# Altium schematic sheet SeptinaryAI_Balldi__elec_driver__driver_2023-07-21.schdoc
size 671 x 250 mm
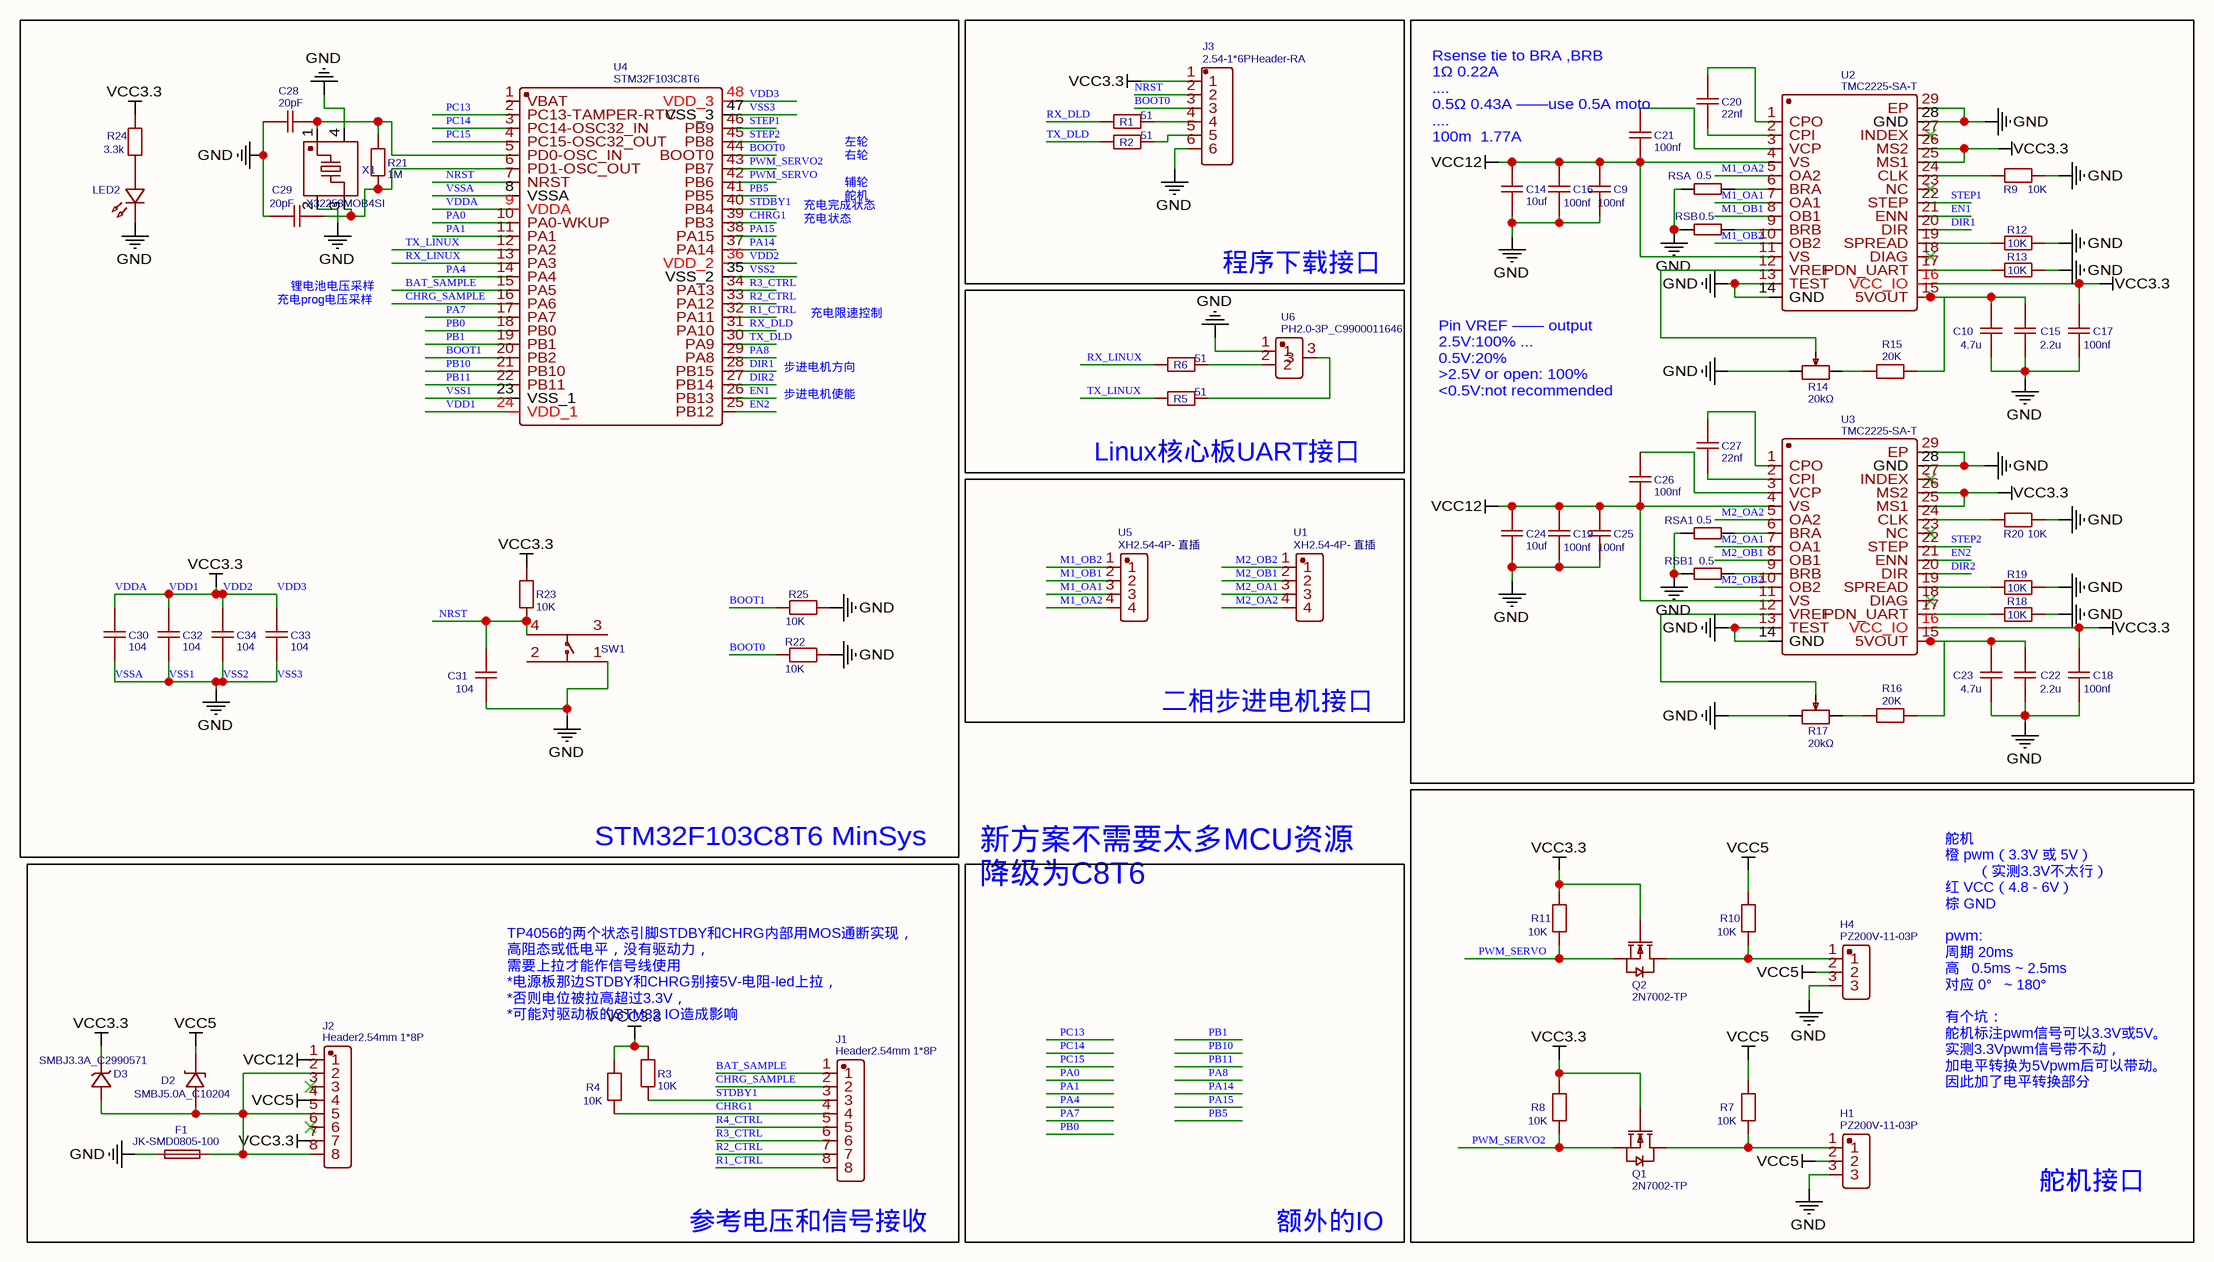
[diagram p0: SeptinaryAI_Balldi__elec_driver__driver_2023-07-21.schdoc]

## Parts
C9  100nf  [C0603]
C10  4.7u  [C0603]
C14  10uf  [C0603]
C15  2.2u  [C0603]
C16  100nf  [C0603]
C17  100nf  [C0603]
C18  100nf  [C0603]
C19  100nf  [C0603]
C20  22nf  [C0603]
C21  100nf  [C0603]
C22  2.2u  [C0603]
C23  4.7u  [C0603]
C24  10uf  [C0603]
C25  100nf  [C0603]
C26  100nf  [C0603]
C27  22nf  [C0603]
C28  20pF  [C0603]
C29  20pF  [C0603]
C30  104  [C0603]
C31  104  [C0603]
C32  104  [C0603]
C33  104  [C0603]
C34  104  [C0603]
D2  SMBJ5.0A_C10204  [SMB_L4.6-W3.6-LS5.3-R-RD]
D3  SMBJ3.3A_C2990571  [SMB_L4.6-W3.6-LS5.3-R-RD]
F1  JK-SMD0805-100  [F0805]
H1  PZ200V-11-03P  [HDR-TH_3P-P2.00-V-M]
H4  PZ200V-11-03P  [HDR-TH_3P-P2.00-V-M]
J1  Header2.54mm 1*8P  [HDR-TH_8P-P2.54-V-M]
J2  Header2.54mm 1*8P  [HDR-TH_8P-P2.54-V-M]
J3  2.54-1*6PHeader-RA  [HDR-TH_6P-P2.54-H-M-W10.0]
LED2  LC191TBCT  [LED0603-RD]  (value not drawn)
Q1  2N7002-TP  [SOT-23-3_L2.9-W1.3-P1.90-LS2.4-BR]
Q2  2N7002-TP  [SOT-23-3_L2.9-W1.3-P1.90-LS2.4-BR]
R1  51  [R0603]
R2  51  [R0603]
R3  10K  [R0603]
R4  10K  [R0603]
R5  51  [R0603]
R6  51  [R0603]
R7  10K  [R0603]
R8  10K  [R0603]
R9  10K  [R0603]
R10  10K  [R0603]
R11  10K  [R0603]
R12  10K  [R0603]
R13  10K  [R0603]
R14  20kΩ  [RES-ADJ-SMD_EVM3ESX50B24]
R15  20K  [R0603]
R16  20K  [R0603]
R17  20kΩ  [RES-ADJ-SMD_EVM3ESX50B24]
R18  10K  [R0603]
R19  10K  [R0603]
R20  10K  [R0603]
R21  1M  [R0603]
R22  10K  [R0603]
R23  10K  [R0603]
R24  3.3k  [R0603]
R25  10K  [R0603]
RSA  0.5  [R1206]
RSA1  0.5  [R1206]
RSB  0.5  [R1206]
RSB1  0.5  [R1206]
SW1  K2-1109SP-A4SA  [KEY-SMD_4P-L4.5-W4.5-P3.00-LS7.0]  (value not drawn)
U1  XH2.54-4P- 直插  [CONN-TH_4P-P2.50-XH2.54-4P]
U2  TMC2225-SA-T  [HTSSOP-28_L9.8-W4.5-P0.65-LS6.6-BL-EP]
U3  TMC2225-SA-T  [HTSSOP-28_L9.8-W4.5-P0.65-LS6.6-BL-EP]
U4  STM32F103C8T6  [LQFP-48_L7.0-W7.0-P0.50-LS9.0-BL]
U5  XH2.54-4P- 直插  [CONN-TH_4P-P2.50-XH2.54-4P]
U6  PH2.0-3P_C9900011646  [CONN-TH_3P-P2.00_HX20007-3A]
X1  X32258MOB4SI  [OSC-SMD_4P-L3.2-W2.5-BL]

## Blocks framed on the sheet
STM32F103C8T6 MinSys: C28-C34 LED2 R21-R25 SW1 U4 X1
程序下载接口: J3 R1 R2
舵机接口: H1 H4 Q1 Q2 R7 R8 R10 R11

## Nets
VCC5: D2.2(K) H1.2 H4.2 J2.4 R7.1 R10.1
VCC12: C9.2 C14.2 C16.2 C19.2 C21.1 C24.2 C25.2 C26.1 J2.1 U2.4(VS) U2.11(VS) U3.4(VS) U3.11(VS)
VDD1: C17.2 C18.2 C30.2 C32.2 C33.2 C34.2 D3.2(C) J2.7 J3.1 Q1.1(G) Q2.1(G) R3.1 R4.1 R8.1 R11.1 R23.2 R24.2 U2.16(VCC_IO) U2.25(MS1) U2.26(MS2) U3.16(VCC_IO) U3.25(MS1) U3.26(MS2) U4.9(VDDA) U4.24(VDD_1) U4.36(VDD_2) U4.48(VDD_3)  [also labelled VCC3.3, VDD2, VDD3, VDDA]
VSS1: C9.1 C10.1 C14.1 C15.1 C16.1 C17.1 C18.1 C19.1 C22.1 C23.1 C24.1 C25.1 C28.2 C29.2 C30.1 C31.1 C32.1 C33.1 C34.1 F1.1 H1.3 H4.3 J3.6 LED2.1(K) R9.2 R12.2 R13.2 R14.3 R17.3 R18.2 R19.2 R20.2 R22.1 R25.1 RSA.1 RSA1.1 RSB.1 RSB1.1 SW1.1 U2.13(TEST) U2.14(GND) U2.28(GND) U2.29(EP) U3.13(TEST) U3.14(GND) U3.28(GND) U3.29(EP) U4.8(VSSA) U4.23(VSS_1) U4.35(VSS_2) U4.47(VSS_3) U6.1 X1.2(GND) X1.4(GND)  [also labelled GND, VSS2, VSS3, VSSA]
BAT_SAMPLE: J1.1 U4.15(PA5)
BOOT0: J3.3 R22.2 U4.44(BOOT0)
BOOT1: R25.2 U4.20(PB2)
CHRG1: J1.4 R4.2 U4.39(PB3)
CHRG_SAMPLE: J1.2 U4.16(PA6)
DIR1: U2.20(DIR) U4.28(PB15)
DIR2: U3.20(DIR) U4.27(PB14)
EN1: U2.21(ENN) U4.26(PB13)
EN2: U3.21(ENN) U4.25(PB12)
M1_OA1: U2.7(OA1) U5.3
M1_OA2: U2.5(OA2) U5.4
M1_OB1: U2.8(OB1) U5.2
M1_OB2: U2.10(OB2) U5.1
M2_OA1: U1.3 U3.7(OA1)
M2_OA2: U1.4 U3.5(OA2)
M2_OB1: U1.2 U3.8(OB1)
M2_OB2: U1.1 U3.10(OB2)
NRST: C31.2 J3.2 R23.1 SW1.4 U4.7(NRST)
PA0: U4.10(PA0-WKUP)
PA1: U4.11(PA1)
PA4: U4.14(PA4)
PA7: U4.17(PA7)
PA8: U4.29(PA8)
PA14: U4.37(PA14)
PA15: U4.38(PA15)
PB0: U4.18(PB0)
PB1: U4.19(PB1)
PB5: U4.41(PB5)
PB10: U4.21(PB10)
PB11: U4.22(PB11)
PC13: U4.2(PC13-TAMPER-RTC)
PC14: U4.3(PC14-OSC32_IN)
PC15: U4.4(PC15-OSC32_OUT)
PWM_SERVO: Q2.2(S) R11.2 U4.42(PB6)
PWM_SERVO2: Q1.2(S) R8.2 U4.43(PB7)
R1_CTRL: J1.8 U4.32(PA11)
R2_CTRL: J1.7 U4.33(PA12)
R3_CTRL: J1.6 U4.34(PA13)
R4_CTRL: J1.5
RX_DLD: R1.1 U4.31(PA10)
RX_LINUX: R6.1 U4.13(PA3)
STDBY1: J1.3 R3.2 U4.40(PB4)
STEP1: U2.22(STEP) U4.46(PB9)
STEP2: U3.22(STEP) U4.45(PB8)
TX_DLD: R2.1 U4.30(PA9)
TX_LINUX: R5.1 U4.12(PA2)
NetC10_2: C10.2 C15.2 R15.2 U2.15(5VOUT)
NetC20_1: C20.1 U2.2(CPI)
NetC20_2: C20.2 U2.1(CPO)
NetC21_2: C21.2 U2.3(VCP)
NetC22_2: C22.2 C23.2 R16.2 U3.15(5VOUT)
NetC26_2: C26.2 U3.3(VCP)
NetC27_1: C27.1 U3.2(CPI)
NetC27_2: C27.2 U3.1(CPO)
NetC28_1: C28.1 R21.1 U4.5(PD0-OSC_IN) X1.1
NetC29_1: C29.1 R21.2 U4.6(PD1-OSC_OUT) X1.3
NetD2_1: D2.1(A) D3.1(A) F1.2 J2.2 J2.5 J2.8
NetH1_1: H1.1 Q1.3(D) R7.2
NetH4_1: H4.1 Q2.3(D) R10.2
NetJ3_4: J3.4 R1.2
NetJ3_5: J3.5 R2.2
NetLED2_2: LED2.2(A) R24.1
NetR5_2: R5.2 U6.3
NetR6_2: R6.2 U6.2
NetR9_1: R9.1 U2.24(CLK)
NetR12_1: R12.1 U2.19(SPREAD)
NetR13_1: R13.1 U2.17(PDN_UART)
NetR14_1: R14.1 R15.1
NetR14_2: R14.2 U2.12(VREF)
NetR16_1: R16.1 R17.1
NetR17_2: R17.2 U3.12(VREF)
NetR18_1: R18.1 U3.17(PDN_UART)
NetR19_1: R19.1 U3.19(SPREAD)
NetR20_1: R20.1 U3.24(CLK)
NetRSA1_2: RSA1.2 U3.6(BRA)
NetRSA_2: RSA.2 U2.6(BRA)
NetRSB1_2: RSB1.2 U3.9(BRB)
NetRSB_2: RSB.2 U2.9(BRB)

Not connected (* = marked no-connect by the designer): J2 3* 6*; SW1 2 3; U2 18(DIAG)* 23(NC)* 27(INDEX)*; U3 18(DIAG)* 23(NC)* 27(INDEX)*; U4 1(VBAT)

## Notes on the sheet
- Rsense tie to BRA ,BRB
  1Ω 0.22A
  ....
  0.5Ω 0.43A ——use 0.5A moto
  ....
  100m  1.77A
- 左轮
  右轮
  辅轮
  舵机
- 充电完成状态
- 充电状态
- 充电prog电压采样
- 锂电池电压采样
- Pin VREF —— output
  2.5V:100% ...
  0.5V:20%
  >2.5V or open: 100%
  <0.5V:not recommended
- 步进电机方向
- 充电限速控制
- 步进电机使能
- (near R5) Linux核心板UART接口
- 二相步进电机接口
- 新方案不需要太多MCU资源
  降级为C8T6
- 舵机
  橙 pwm（3.3V 或 5V）
  （实测3.3V不太行）
  红 VCC（4.8 - 6V）
  棕 GND
  pwm:
  周期 20ms
  高   0.5ms ~ 2.5ms
  对应 0°   ~ 180°
  有个坑：
  舵机标注pwm信号可以3.3V或5V。
  实测3.3Vpwm信号带不动，
  加电平转换为5Vpwm后可以带动。
  因此加了电平转换部分
- (near R3) TP4056的两个状态引脚STDBY和CHRG内部用MOS通断实现，
  高阻态或低电平，没有驱动力，
  需要上拉才能作信号线使用
  *电源板那边STDBY和CHRG别接5V-电阻-led上拉，
  *否则电位被拉高超过3.3V，
  *可能对驱动板的STM32 IO造成影响
- (near J1) 参考电压和信号接收
- 额外的IO

## Library data of the parts
C9 C16-C19 C21 C25 C26 = 100nf: nameAlias: Value(F); Contributor: LCEDA_Lib; spicePre: C; spiceSymbolName: C_0603_US
C10 C23 = 4.7u: BOM_Manufacturer: SAMSUNG(三星); nameAlias: Capacitance; Contributor: LCSC; spicePre: C; spiceSymbolName: CL10F104ZO8NNNC
C14 C24 = 10uf: nameAlias: Value(F); Contributor: LCEDA_Lib; spicePre: C; spiceSymbolName: C_0603_US
C15 C22 = 2.2u: BOM_Manufacturer: SAMSUNG(三星); nameAlias: Capacitance; Contributor: LCSC; spicePre: C; spiceSymbolName: CL10F104ZO8NNNC
C20 C27 = 22nf: nameAlias: Value(F); Contributor: LCEDA_Lib; spicePre: C; spiceSymbolName: C_0603_US
C28 C29 = 20pF: BOM_Manufacturer: SAMSUNG(三星); nameAlias: Capacitance; Contributor: LCSC; spicePre: C; spiceSymbolName: CL10F104ZO8NNNC
C30-C34 = 104: BOM_Manufacturer: SAMSUNG(三星); nameAlias: Capacitance; Contributor: LCSC; spicePre: C; spiceSymbolName: CL10F104ZO8NNNC
D2 = SMBJ5.0A_C10204: BOM_Manufacturer: RUILON; Package Display: No; spicePre: D; spiceSymbolName: SMBJ5.0A_C10204
D3 = SMBJ3.3A_C2990571: BOM_Manufacturer: RUILON(瑞隆源); Contributor: lcsc; BOM_Supplier: LCSC; BOM_Supplier Part: C2990571; BOM_Manufacturer Part: SMBJ3.3A; link: https://atta.szlcsc.com/upload/public/pdf/source/20180716/C29715_E6EABBF81195B419C59879CD6F1DD929.pdf; BOM_JLCPCB Part Class: Extended Part; spicePre: D; spiceSymbolName: SMBJ3.3A_C2990571
F1 = JK-SMD0805-100: BOM_Manufacturer: Jinrui Electronic Materials Co.; Contributor: LCSC; spicePre: F; spiceSymbolName: JK-SMD0805-100
H1 H4 = PZ200V-11-03P: BOM_Manufacturer: XFCN; Contributor: LCSC; spicePre: H; spiceSymbolName: PZ200V-11-03P
J1 J2 = Header2.54mm 1*8P: BOM_Manufacturer: ReliaPro; spicePre: J; spiceSymbolName: Header2.54mm 1*8P
J3 = 2.54-1*6PHeader-RA: BOM_Manufacturer: BOOMELE; spicePre: X; spiceSymbolName: 2.54-1*6PHeader-RA
LED2 = LC191TBCT: BOM_Manufacturer: PARALIGHT; Contributor: LCSC; spicePre: L; spiceSymbolName: LC191TBCT
Q1 Q2 = 2N7002-TP: BOM_Manufacturer: MCC(Micro Commercial Components); Contributor: LCSC; spicePre: Q; spiceSymbolName: 2N7002-TP
R1 R2 R5 R6 = 51: BOM_Manufacturer: VISHAY(威世); nameAlias: Resistance; Contributor: LCSC; spicePre: R; spiceSymbolName: TNPW0603130RBEEA
R3 R4 R7-R13 R18-R20 R22 R23 R25 = 10K: BOM_Manufacturer: VISHAY(威世); nameAlias: Resistance; Contributor: LCSC; spicePre: R; spiceSymbolName: TNPW0603130RBEEA
R14 R17 = 20kΩ: BOM_Manufacturer: PANASONIC(松下); BOM_Manufacturer Part: EVM3ESX50B24; nameAlias: Resistance; Resistance(Ohms): 20K; BOM_Supplier: LCSC; BOM_Supplier Part: C11957; Resistance (Ohms): 20K; BOM_JLCPCB Part Class: Extended Part; spicePre: R; spiceSymbolName: EVM3ESX50B24
R15 R16 = 20K: BOM_Manufacturer: VISHAY(威世); nameAlias: Resistance; Contributor: LCSC; spicePre: R; spiceSymbolName: TNPW0603130RBEEA
R21 = 1M: BOM_Manufacturer: VISHAY(威世); nameAlias: Resistance; Contributor: LCSC; spicePre: R; spiceSymbolName: TNPW0603130RBEEA
R24 = 3.3k: BOM_Manufacturer: VISHAY(威世); nameAlias: Resistance; Contributor: LCSC; spicePre: R; spiceSymbolName: TNPW0603130RBEEA
RSA RSA1 RSB RSB1 = 0.5: BOM_Manufacturer: UniOhm; nameAlias: Resistance (Ohms); spicePre: R; spiceSymbolName: 1206W4F500LT5E
SW1 = K2-1109SP-A4SA: BOM_Manufacturer: HRO; spicePre: S; spiceSymbolName: K2-1109SP-A4SA
U1 U5 = XH2.54-4P- 直插: BOM_Manufacturer: null; Contributor: LCSC; BOM_Supplier: LCSC; BOM_Supplier Part: C9900000103; BOM_Manufacturer Part: XH2.54-4P- 直插; BOM_JLCPCB Part Class: Extended Part; spicePre: U; spiceSymbolName: XH2.54-4P- 直插
U2 U3 = TMC2225-SA-T: BOM_Manufacturer: TRINAMIC; Contributor: LCSC; BOM_Supplier: LCSC; BOM_Supplier Part: C516358; BOM_Manufacturer Part: TMC2225-SA-T; BOM_JLCPCB Part Class: Extended Part; spicePre: U; spiceSymbolName: TMC2225-SA-T
U4 = STM32F103C8T6: BOM_Manufacturer: ST(意法半导体); timeStamp: 1455028086; BOM_Supplier: LCSC; BOM_Manufacturer Part: STM32F103C8T6; BOM_Supplier Part: C8734; BOM_JLCPCB Part Class: Basic Part; spicePre: U; spiceSymbolName: STM32F103C8T6
U6 = PH2.0-3P_C9900011646: BOM_Manufacturer: null; Contributor: LCSC; BOM_Supplier: LCSC; BOM_Supplier Part: C9900011646; BOM_Manufacturer Part: PH2.0-3P; BOM_JLCPCB Part Class: Extended Part; spicePre: U; spiceSymbolName: PH2.0-3P_C9900011646
X1 = X32258MOB4SI: BOM_Manufacturer: YXC扬兴科技; Contributor: LCSC; spicePre: X; spiceSymbolName: X32258MOB4SI